# EAGLE schematic FA3D_Prelim (EAGLE 8.7.1)

## Sheet 1 of 2
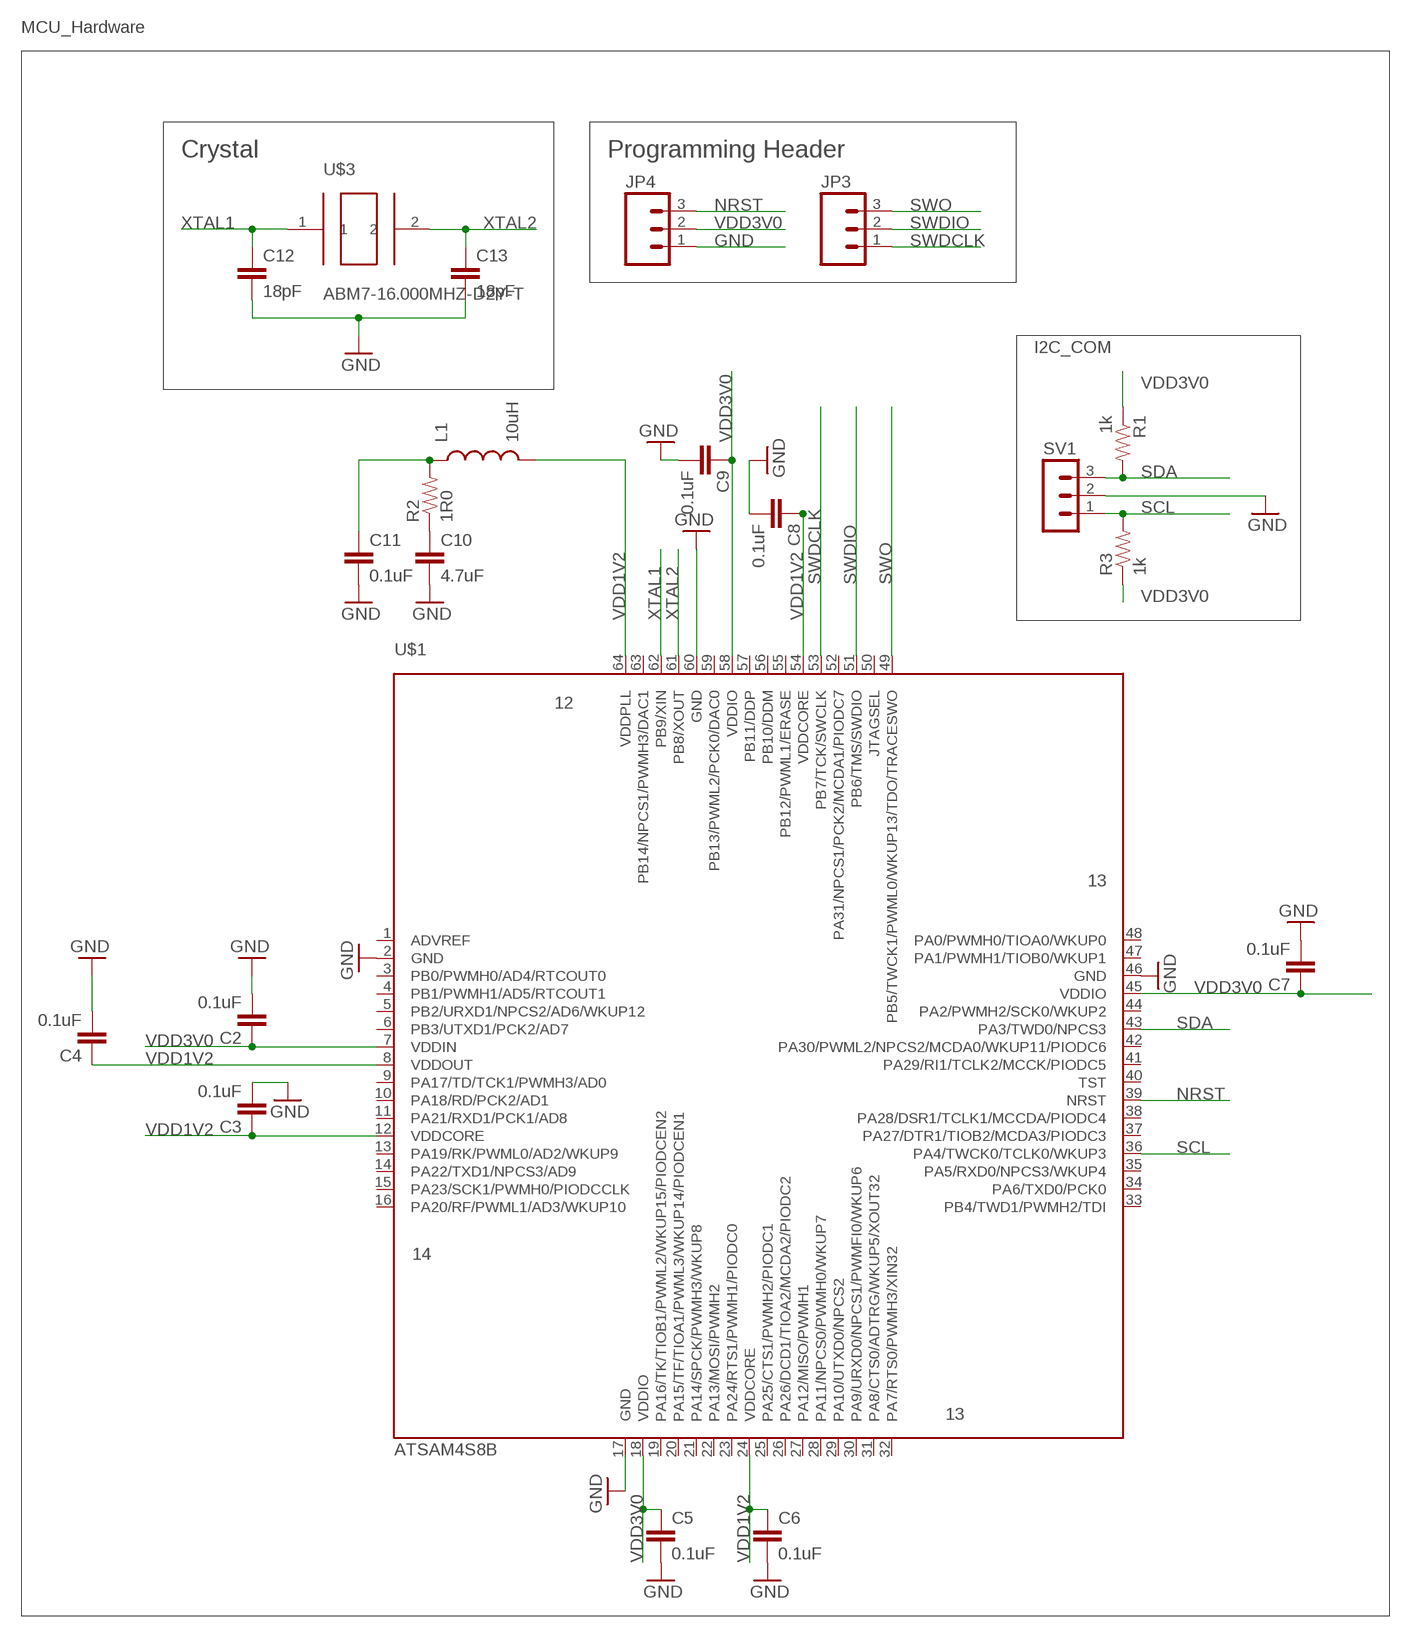
[diagram p0: schematic, sheet 1]

### Parts
C2  0.1uF  CAP0805  [0805]
C3  0.1uF  CAP0805  [0805]
C4  0.1uF  CAP0805  [0805]
C5  0.1uF  CAP0805  [0805]
C6  0.1uF  CAP0805  [0805]
C7  0.1uF  CAP0805  [0805]
C8  0.1uF  CAP0805  [0805]
C9  0.1uF  CAP0805  [0805]
C10  4.7uF  CAP0805  [0805]
C11  0.1uF  CAP0805  [0805]
C12  18pF  CAP0805  [0805]
C13  18pF  CAP0805  [0805]
JP3  M03PTH  [1X03]
JP4  M03PTH  [1X03]
L1  10uH  INDUCTOR0805  [0805]
R1  1k  RESISTOR0805-RES  [0805]
R2  1R0  RESISTOR0805-RES  [0805]
R3  1k  RESISTOR0805-RES  [0805]
SV1  MA03-1  [MA03-1]
U$1  ATSAM4S8B  [QFP50P1200X1200X160-64N]
U$3  ABM7-16.000MHZ-D2Y-T  [ABM7-16.000MHZ-D2Y-T]

### Nets
GND: C2.2 C3.2 C4.2 C5.2 C6.2 C7.2 C8.2 C9.2 C10.2 C11.2 C12.2 C13.2 JP4.1 SV1.2 U$1.2(GND) U$1.17(GND) U$1.46(GND) U$1.60(GND)
N$2: C11.1 L1.1 R2.2
N$3: C10.1 R2.1
NRST: JP4.3 U$1.39(NRST)
SCL: R3.2 SV1.1 U$1.36(PA4/TWCK0/TCLK0/WKUP3)
SDA: R1.2 SV1.3 U$1.43(PA3/TWD0/NPCS3)
SWDCLK: JP3.1 U$1.53(PB7/TCK/SWCLK)
SWDIO: JP3.2 U$1.51(PB6/TMS/SWDIO)
SWO: JP3.3 U$1.49(PB5/TWCK1/PWML0/WKUP13/TDO/TRACESWO)
VDD1V2: C3.1 C4.1 C6.1 C8.1 L1.2 U$1.8(VDDOUT) U$1.12(VDDCORE) U$1.24(VDDCORE) U$1.54(VDDCORE) U$1.64(VDDPLL)
VDD3V0: C2.1 C5.1 C7.1 C9.1 JP4.2 R1.1 R3.1 U$1.7(VDDIN) U$1.18(VDDIO) U$1.45(VDDIO) U$1.58(VDDIO)
XTAL1: C12.1 U$1.62(PB9/XIN) U$3.1
XTAL2: C13.1 U$1.61(PB8/XOUT) U$3.2
Unconnected: U$1.1(ADVREF) U$1.3(PB0/PWMH0/AD4/RTCOUT0) U$1.4(PB1/PWMH1/AD5/RTCOUT1) U$1.5(PB2/URXD1/NPCS2/AD6/WKUP12) U$1.6(PB3/UTXD1/PCK2/AD7) U$1.9(PA17/TD/TCK1/PWMH3/AD0) U$1.10(PA18/RD/PCK2/AD1) U$1.11(PA21/RXD1/PCK1/AD8) U$1.13(PA19/RK/PWML0/AD2/WKUP9) U$1.14(PA22/TXD1/NPCS3/AD9) U$1.15(PA23/SCK1/PWMH0/PIODCCLK) U$1.16(PA20/RF/PWML1/AD3/WKUP10) U$1.19(PA16/TK/TIOB1/PWML2/WKUP15/PIODCEN2) U$1.20(PA15/TF/TIOA1/PWML3/WKUP14/PIODCEN1) U$1.21(PA14/SPCK/PWMH3/WKUP8) U$1.22(PA13/MOSI/PWMH2) U$1.23(PA24/RTS1/PWMH1/PIODC0) U$1.25(PA25/CTS1/PWMH2/PIODC1) U$1.26(PA26/DCD1/TIOA2/MCDA2/PIODC2) U$1.27(PA12/MISO/PWMH1) U$1.28(PA11/NPCS0/PWMH0/WKUP7) U$1.29(PA10/UTXD0/NPCS2) U$1.30(PA9/URXD0/NPCS1/PWMFI0/WKUP6) U$1.31(PA8/CTS0/ADTRG/WKUP5/XOUT32) U$1.32(PA7/RTS0/PWMH3/XIN32) U$1.33(PB4/TWD1/PWMH2/TDI) U$1.34(PA6/TXD0/PCK0) U$1.35(PA5/RXD0/NPCS3/WKUP4) U$1.37(PA27/DTR1/TIOB2/MCDA3/PIODC3) U$1.38(PA28/DSR1/TCLK1/MCCDA/PIODC4) U$1.40(TST) U$1.41(PA29/RI1/TCLK2/MCCK/PIODC5) U$1.42(PA30/PWML2/NPCS2/MCDA0/WKUP11/PIODC6) U$1.44(PA2/PWMH2/SCK0/WKUP2) U$1.47(PA1/PWMH1/TIOB0/WKUP1) U$1.48(PA0/PWMH0/TIOA0/WKUP0) U$1.50(JTAGSEL) U$1.52(PA31/NPCS1/PCK2/MCDA1/PIODC7) U$1.55(PB12/PWML1/ERASE) U$1.56(PB10/DDM) U$1.57(PB11/DDP) U$1.59(PB13/PWML2/PCK0/DAC0) U$1.63(PB14/NPCS1/PWMH3/DAC1)

### Notes on the sheet
- MCU_Hardware
- Crystal | Programming Header
- I2C_COM
- 12
- 13
- 14
- 13

## Sheet 2 of 2

## Library data of the parts
C2-C13 = SparkFun:CAP: Capacitor Standard 0603 ceramic capacitor, and 0.1" leaded capacitor.
JP3 JP4 = SparkFun:M03: Header 3 Standard 3-pin 0.1" header. Use with straight break away headers (SKU : PRT-00116), right angle break away headers (PRT-00553), swiss pins (PRT-00743), machine pins (PRT-00117), and female headers (PRT-00115). Molex polarized connector foot print use with SKU : PRT-08232 with associated crimp pins and housings.
L1 = SparkFun:INDUCTOR: Inductors Basic Inductor/Choke - 0603 and 1206. Footprints are not proven and vary greatly between part numbers.
R1-R3 = SparkFun:RESISTOR: Resistor Basic schematic elements and footprints for 0603, 1206, and PTH resistors.
SV1 = con-lstb:MA03-1: PIN HEADER; OC_FARNELL: unknown; OC_NEWARK: unknown
U$1 = Ilya:ATSAM4S8B
U$3 = Ilya:ABM7-16.000MHZ-D2Y-T